# EAGLE design TurquoiseBicuspidProgrammer (EAGLE 6.5.0)
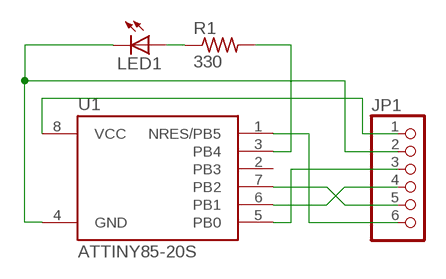
[diagram p0: schematic, sheet 1]

## Parts
JP1  PINHD-1X6  [1X06]
LED1  LED5MM  [LED5MM]
R1  330  R-US_0207/10  [0207/10]
U1  ATTINY85-20S  [SOIC8_EIAJ_208MIL]

## Nets
N$1: JP1.1 U1.8(VCC)
N$2: JP1.2 LED1.K(C) U1.4(GND)
N$3: JP1.6 U1.1(NRES/PB5)
N$4: JP1.3 U1.5(PB0)
N$6: JP1.4 U1.6(PB1)
N$7: JP1.5 U1.7(PB2)
N$8: R1.2 U1.3(PB4)
N$9: LED1.A R1.1
Unconnected: U1.2(PB3)

## Library data of the parts
JP1 = pinhead:PINHD-1X6: PIN HEADER
LED1 = led:LED: LED OSRAM: - CHIPLED LG R971, LG N971, LY N971, LG Q971, LY Q971, LO R971, LY R971 LH N974, LH R974 LS Q976, LO Q976, LY Q976 LO Q996 - Hyper CHIPLED LW Q18S LB Q993, LB Q99A, LB R99A - SideLED LS A670, LO A670, LY A670, LG A670, LP A670 LB A673, LV A673, LT A673, LW A673 LH A674 LY A675 LS A676, LA A676, LO A676, LY A676, LW A676 LS A679, LY A679, LG A679 - Hyper Micro SIDELED® LS Y876, LA Y876, LO Y876, LY Y876 LT Y87S - SmartLED LW L88C, LW L88S LB L89C, LB L89S, LG L890 LS L89K, LO L89K, LY L89K LS L896, LA L896, LO L896, LY L896 - TOPLED LS T670, LO T670, LY T670, LG T670, LP T670 LSG T670, LSP T670, LSY T670, LOP T670, LYG T670 LG T671, LOG T671, LSG T671 LB T673, LV T673, LT T673, LW T673 LH T674 LS T676, LA T676, LO T676, LY T676, LB T676, LH T676, LSB T676, LW T676 LB T67C, LV T67C, LT T67C, LS T67K, LO T67K, LY T67K, LW E67C LS E67B, LA E67B, LO E67B, LY E67B, LB E67C, LV E67C, LT E67C LW T67C LS T679, LY T679, LG T679 LS T770, LO T770, LY T770, LG T770, LP T770 LB T773, LV T773, LT T773, LW T773 LH T774 LS E675, LA E675, LY E675, LS T675 LS T776, LA T776, LO T776, LY T776, LB T776 LHGB T686 LT T68C, LB T68C - Hyper Mini TOPLED® LB M676 - Mini TOPLED Santana® LG M470 LS M47K, LO M47K, LY M47K Source: http://www.osram.convergy.de LUXEON: - LUMILED® LXK2-PW12-R00, LXK2-PW12-S00, LXK2-PW14-U00, LXK2-PW14-V00 LXK2-PM12-R00, LXK2-PM12-S00, LXK2-PM14-U00 LXK2-PE12-Q00, LXK2-PE12-R00, LXK2-PE12-S00, LXK2-PE14-T00, LXK2-PE14-U00 LXK2-PB12-K00, LXK2-PB12-L00, LXK2-PB12-M00, LXK2-PB14-N00, LXK2-PB14-P00, LXK2-PB14-Q00 LXK2-PR12-L00, LXK2-PR12-M00, LXK2-PR14-Q00, LXK2-PR14-R00 LXK2-PD12-Q00, LXK2-PD12-R00, LXK2-PD12-S00 LXK2-PH12-R00, LXK2-PH12-S00 LXK2-PL12-P00, LXK2-PL12-Q00, LXK2-PL12-R00 Source: www.luxeon.com KINGBRIGHT: KA-3528ASYC Source: www.kingbright.com
R1 = rcl:R-US_: RESISTOR, American symbol
U1 = _hhn_attiny25_45_85:ATTINY85*: ATMEL ATtiny 85 Packages: P = PDIP 08 30mil S = SOIC 08 EIAJ 208mil Technologies Note: for complete ordering code (temp. range, finish, tape&reel etc.) see www.atmel.com • Supply Voltage: V = (1.8…5.5)V | [blank] = (2.7…5.5)V • Speed: 10 = 10 MHz | 20 = 20 MHz Author: Dipl.-Ing. FH Rainer Bayer HHN Hochschule Heilbronn (Heilbronn University), rainer.bayer@hs-heilbronn.de Ingenieurbüro ing-rb, mail@ing-rb.de

## Board
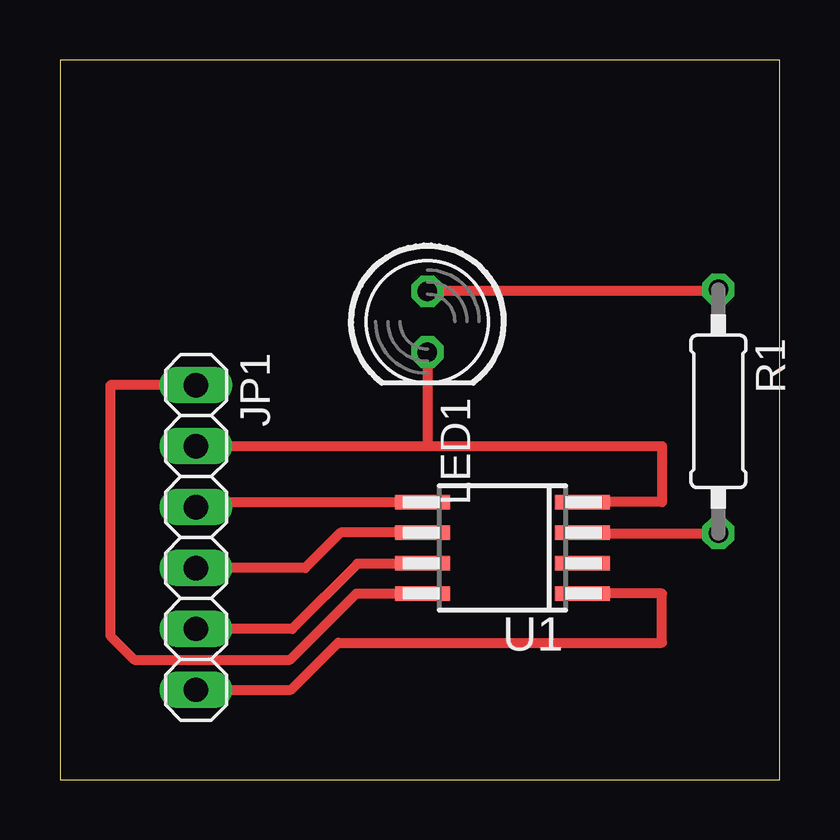
[diagram p1: board, top side]

Size 30 x 30 mm. Coordinates in mm from the lower left corner, seen from the top.
Outline: 0,0 30,0 30,30 0,30 0,0
Copper layers (1*16): Top 0.035mm / dielectric 1.5mm / Bottom 0.035mm
Design rules "default": minimum track width 10mil, minimum drill 24mil, track to track 8mil, track to pad 8mil, pad to pad 8mil, via to via 8mil, smd to smd 8mil, copper to edge 40mil, drill to drill 8mil, minimum pad ring 10mil, minimum via ring 8mil, stop-mask expansion 4mil, vias tented up to drill 0mil, thermal gap 10mil

### Footprints (pad centres in the part's own frame; a part is rotated, then mirrored left to right if it is on the bottom)
1X06 = drill 1.016 long: 1 -6.35,0; 2 -3.81,0; 3 -1.27,0; 4 1.27,0; 5 3.81,0; 6 6.35,0
LED5MM = drill 0.813 octagon: A -1.27,0; K 1.27,0
0207/10 = drill 0.813 octagon: 1 -5.08,0; 2 5.08,0
SOIC8_EIAJ_208MIL = smd 0.6 x 2.286: 1 -1.905,-3.33; 2 -0.635,-3.33; 3 0.635,-3.33; 4 1.905,-3.33; 5 1.905,3.33; 6 0.635,3.33; 7 -0.635,3.33; 8 -1.905,3.33

### Placement (x,y rotation side)
JP1  5.67,10.09 270 top
LED1  15.32,19.09 270 top
R1  27.45,15.35 270 top
U1  18.45,9.66 90 top

### Tracks (layer width: path | path; a pad name or v marks a point on that pad's centre or on a via)
N$1
  Top 0.406: JP1.1 2.1,16.44 2.1,6 3.1,5 9.6,5 12.36,7.75 U1.8
N$2
  Top 0.406: JP1.2 15.32,13.9 | U1.4 25.1,11.56 25.1,13.9 15.4,13.9 15.32,13.9 | LED1.K 15.32,13.9
N$3
  Top 0.406: JP1.6 9.64,3.74 11.6,5.7 25.1,5.7 25.1,7.75 U1.1
N$4
  Top 0.406: JP1.3 5.67,11.56 U1.5
N$6
  Top 0.406: U1.6 11.7,10.3 10.22,8.82 JP1.4
N$7
  Top 0.406: U1.7 15.1,9 12.4,9 9.68,6.28 JP1.5
N$8
  Top 0.406: U1.3 21.78,10.27 R1.2
N$9
  Top 0.406: R1.1 27.45,20.36 LED1.A